# EAGLE design Electrodes (EAGLE 8.2.2)
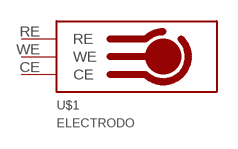
[diagram p0: schematic, sheet 1]

## Parts
U$1  ELECTRODO  [ELECTRODO]
Unconnected: U$1.CE U$1.RE U$1.WE

## Library data of the parts
U$1 = killan:ELECTRODO

## Board
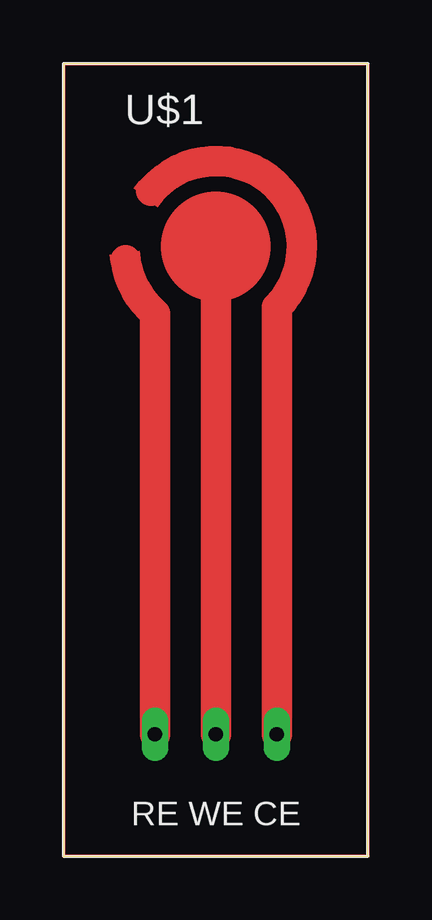
[diagram p1: board, top side]
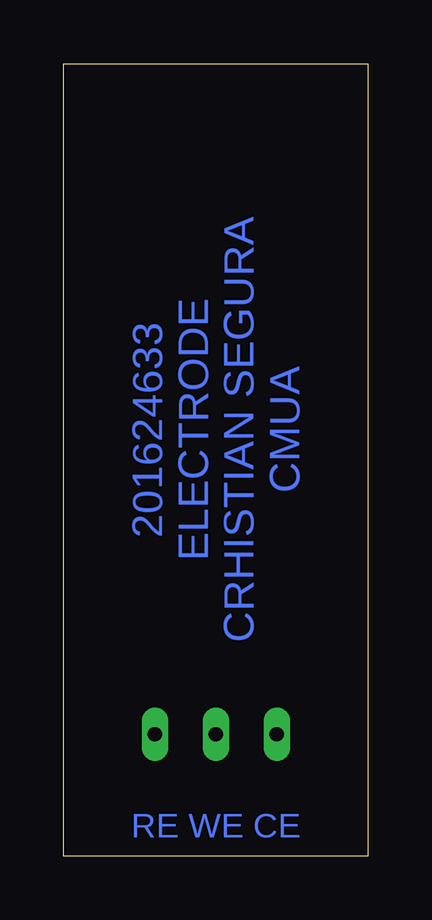
[diagram p2: board, bottom side, seen from below]

Size 12.7 x 33.02 mm. Coordinates in mm from the lower left corner, seen from the top.
Outline: 0,0 12.7,0 12.7,33.02 0,33.02 0,0
Copper layers (1*16): Top 0.035mm / dielectric 1.5mm / Bottom 0.035mm
Design rules "default *": minimum track width 6mil, minimum drill 0.35mm, track to track 15mil, track to pad 15mil, pad to pad 15mil, via to via 15mil, smd to smd 6mil, copper to edge 40mil, drill to drill 6mil, minimum pad ring 10mil, minimum via ring 8mil, stop-mask expansion 4mil, vias tented up to drill 0mil, thermal gap 10mil

### Footprints (pad centres in the part's own frame; a part is rotated, then mirrored left to right if it is on the bottom)
ELECTRODO = drill 0.6 long: CE 2.54,1.27; RE -2.54,1.27; WE 0,1.27

### Placement (x,y rotation side)
U$1  6.35,3.81 0 top

### Tracks (layer width: path | path; a pad name or v marks a point on that pad's centre or on a via)
N$4
  Top 0.152: 0,0 0,33.02 12.7,33.02 12.7,0 0,0

### Text on the board
Bottom: 201624633 / ELECTRODE / CRHISTIAN SEGURA / CMUA | RE WE CE